# Altium schematic sheet J-Link On Board with RA4M2.SchDoc
size A3; Company Name: Renesas Electronics America; CompanyURL: www.renesas.com; PageSetup: Record=PageOptions|CenterHorizontal=True|CenterVertical=True|PrintScale=1.00|XCorrection=1.00|YCorrection=1.00|PrintKind=1|BorderSize=5000000|LeftOffset=0|BottomOffset=0|Orientation=2|PaperLength=1000|PaperWidth=1000|Scale=100|PaperSource=7|PrintQuality=-4|MediaType=1|DitherType=10|PaperKind=A5 148x210mm|PrintScaleMode=1; ReleaseDate: 16.09.2025; Version: MP; SheetNumber: 8; SheetTotal: 18; VariantNumber: 0; DSheetNumber: 1
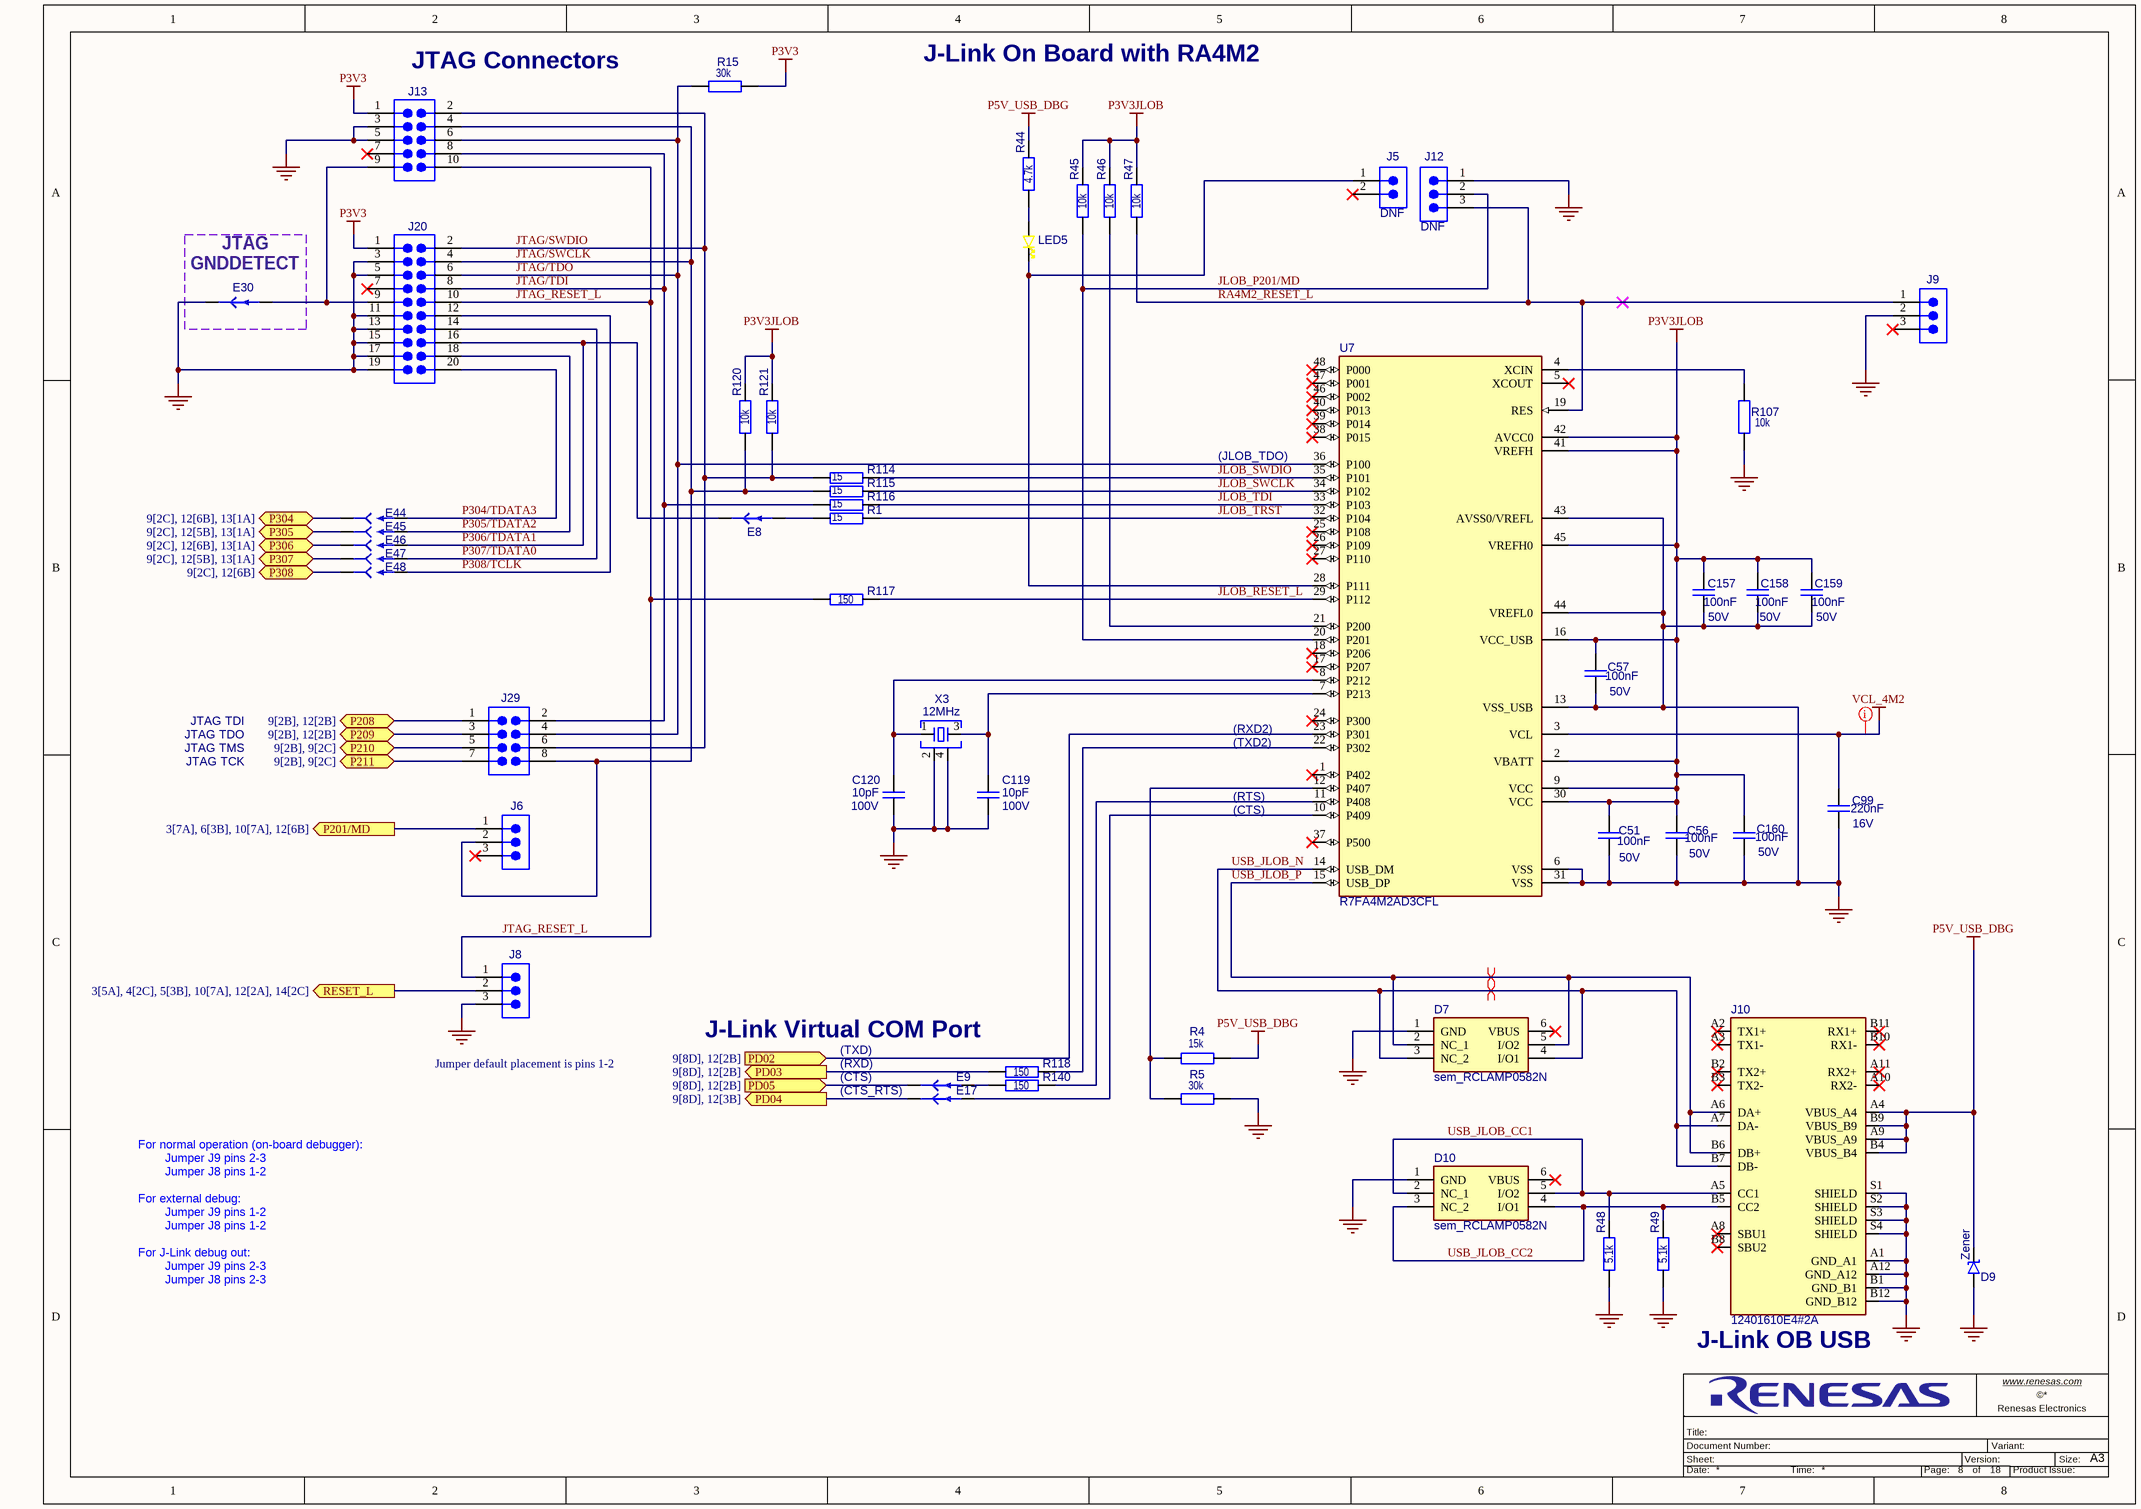
[diagram p0: J-Link On Board with RA4M2.SchDoc]

## Parts
C51  value 100nF  Operating Voltage Max: 50V  [C_EIA0402_0p55]  (hidden comment: Capacitor)
C56  value 100nF  Operating Voltage Max: 50V  [C_EIA0402_0p55]  (hidden comment: Capacitor)
C57  value 100nF  Operating Voltage Max: 50V  [C_EIA0402_0p55]  (hidden comment: Capacitor)
C99  value 220nF  Operating Voltage Max: 16V  [C_EIA0402_0p55]  (hidden comment: Capacitor)
C119  value 10pF  Operating Voltage Max: 100V  [C_EIA0402_0p55]  (hidden comment: Capacitor)
C120  value 10pF  Operating Voltage Max: 100V  [C_EIA0402_0p55]  (hidden comment: Capacitor)
C157  value 100nF  Operating Voltage Max: 50V  [C_EIA0402_0p55]  (hidden comment: Capacitor)
C158  value 100nF  Operating Voltage Max: 50V  [C_EIA0402_0p55]  (hidden comment: Capacitor)
C159  value 100nF  Operating Voltage Max: 50V  [C_EIA0402_0p55]  (hidden comment: Capacitor)
C160  value 100nF  Operating Voltage Max: 50V  [C_EIA0402_0p55]  (hidden comment: Capacitor)
D7  sem_RCLAMP0582N  [sem_SLP-6_SLP1210N6]
D9  Zener  [sem_SGP-2_SGP1610N2]
D10  sem_RCLAMP0582N  [sem_SLP-6_SLP1210N6]
E8  TRACE_CUT_0805  [trace_cut_0805]  (value not drawn)  (net tie, no BOM)
E9  TRACE_CUT_0805  [trace_cut_0805]  (value not drawn)  (net tie, no BOM)
E17  TRACE_CUT_0805  [trace_cut_0805]  (value not drawn)  (net tie, no BOM)
E30  TRACE_CUT_0805  [trace_cut_0805]  (value not drawn)  (net tie, no BOM)
E44  SOLDER_BRIDGE_0805  [solder_bridge_0805]  (value not drawn)  (no BOM)
E45  SOLDER_BRIDGE_0805  [solder_bridge_0805]  (value not drawn)  (no BOM)
E46  SOLDER_BRIDGE_0805  [solder_bridge_0805]  (value not drawn)  (no BOM)
E47  SOLDER_BRIDGE_0805  [solder_bridge_0805]  (value not drawn)  (no BOM)
E48  SOLDER_BRIDGE_0805  [solder_bridge_0805]  (value not drawn)  (no BOM)
J5  NRPN021PAEN-RC  [sul_NRPN021PAEN-RC]  (value not drawn)
J6  2842102-3  [tec_2842102-3]  (value not drawn)
J8  2842102-3  [tec_2842102-3]  (value not drawn)
J9  2842102-3  [tec_2842102-3]  (value not drawn)
J10  12401610E4#2A  [amp_12401610E42A]
J12  NRPN031PAEN-RC  [sul_NRPN031PAEN-RC]  (value not drawn)
J13  FTSH-105-01-F-DV-K-TR  [sam_FTSH-105-01-F-DV-K-TR]  (value not drawn)
J20  FTSH-110-01-F-DV-K-TR  [sam_FTSH-110-01-L-DV-K-TR]  (value not drawn)
J29  NRPN042MAMS-RC  [sul_NRPN042MAMS-RC]  (value not drawn)
LED5  150060YS75000  [led_0603_y]  (value not drawn)
R1  value 15  [R_EIA0402]  (hidden comment: RC0402FR-0715RL)
R4  value 15k  [R_EIA0402]  (hidden comment: RC0402FR-0715KL)
R5  value 30k  [R_EIA0402]  (hidden comment: RC0402FR-0730KL)
R15  value 30k  [R_EIA0402]  (hidden comment: RC0402FR-0730KL)
R44  value 4.7k  [R_EIA0402]  (hidden comment: Resistor)
R45  value 10k  [R_EIA0402]  (hidden comment: Resistor)
R46  value 10k  [R_EIA0402]  (hidden comment: Resistor)
R47  value 10k  [R_EIA0402]  (hidden comment: Resistor)
R48  value 5.1k  [R_EIA0402]  (hidden comment: Resistor)
R49  value 5.1k  [R_EIA0402]  (hidden comment: Resistor)
R107  value 10k  [R_EIA0402]  (hidden comment: Resistor)
R114  value 15  [R_EIA0402]  (hidden comment: RC0402FR-0715RL)
R115  value 15  [R_EIA0402]  (hidden comment: RC0402FR-0715RL)
R116  value 15  [R_EIA0402]  (hidden comment: RC0402FR-0715RL)
R117  value 150  [R_EIA0402]  (hidden comment: Resistor)
R118  value 150  [R_EIA0402]  (hidden comment: Resistor)
R120  value 10k  [R_EIA0402]  (hidden comment: Resistor)
R121  value 10k  [R_EIA0402]  (hidden comment: Resistor)
R140  value 150  [R_EIA0402]  (hidden comment: Resistor)
U7  R7FA4M2AD3CFL  [ren_LQFP-48_PLQP0048KB-B]
X3  value 12MHz  [ecs_ECX-2236B]  (hidden comment: ECS-120-10-36B-CWY-TR)

## Ports
P201/MD (out, see 3[7A], 6[3B], 10[7A], 12[6B]), P208 (bidir, see 9[2B], 12[2B]), P209 (bidir, see 9[2B], 12[2B]), P210 (bidir, see 9[2B], 9[2C]), P211 (bidir, see 9[2B], 9[2C]), P304 (bidir, see 9[2C], 12[6B], 13[1A]), P305 (bidir, see 9[2C], 12[5B], 13[1A]), P306 (bidir, see 9[2C], 12[6B], 13[1A]), P307 (bidir, see 9[2C], 12[5B], 13[1A]), P308 (bidir, see 9[2C], 12[6B]), PD02 (in, see 9[8D], 12[2B]), PD03 (out, see 9[8D], 12[2B]), PD04 (out, see 9[8D], 12[3B]), PD05 (in, see 9[8D], 12[2B]), RESET_L (out, see 3[5A], 4[2C], 5[3B], 10[7A], 12[2A], 14[2C])

## Nets
GND: C51.1 C56.1 C57.1 C99.1 C119.2 C120.2 C157.1 C158.1 C159.1 C160.1 D7.1(GND) D9.2(A) D10.1(GND) E30.1 J8.3 J9.2 J10.A1(GND_A1) J10.A12(GND_A12) J10.B1(GND_B1) J10.B12(GND_B12) J10.S1(SHIELD) J10.S2(SHIELD) J10.S3(SHIELD) J10.S4(SHIELD) J12.1 J13.3 J13.5 J20.3 J20.5 J20.11 J20.13 J20.15 J20.17 J20.19 R5.2 R48.1 R49.1 R107.1 U7.6(VSS) U7.13(VSS_USB) U7.31(VSS) U7.43(AVSS0/VREFL) U7.44(VREFL0) X3.2 X3.4
P3V3: J13.1 J20.1 R15.2
P3V3JLOB: C51.2 C56.2 C57.2 C157.2 C158.2 C159.2 C160.2 R45.2 R46.2 R47.2 R120.2 R121.2 U7.2(VBATT) U7.9(VCC) U7.16(VCC_USB) U7.30(VCC) U7.41(VREFH) U7.42(AVCC0) U7.45(VREFH0)
P5V_USB_DBG: D9.1(K) J10.A4(VBUS_A4) J10.A9(VBUS_A9) J10.B4(VBUS_B4) J10.B9(VBUS_B9) R4.1 R44.2
VCL_4M2: C99.2 U7.3(VCL)
JLOB_P201/MD: J12.2 R45.1 U7.20(P201)
JLOB_RESET_L: R117.2 U7.29(P112)
JLOB_SWCLK: R115.2 U7.34(P102)
JLOB_SWDIO: R114.2 U7.35(P101)
JLOB_TDI: R116.2 U7.33(P103)
JLOB_TRST: R1.2 U7.32(P104)
JTAG/SWCLK: J6.2 J13.4 J20.4 J29.8 R115.1 R120.1
JTAG/SWDIO: J13.2 J20.2 J29.6 R114.1 R121.1
JTAG/TDI: J13.8 J20.8 J29.2 R116.1
JTAG/TDO: J13.6 J20.6 J29.4 R15.1 U7.36(P100)
JTAG_RESET_L: J8.1 J13.10 J20.10 R117.1
P201/MD: J6.1 ; port P201/MD
P208: J29.1 ; port P208
P209: J29.3 ; port P209
P210: J29.5 ; port P210
P211: J29.7 ; port P211
P304: E44.1 ; port P304
P304/TDATA3: E44.2 J20.20
P305: E45.1 ; port P305
P305/TDATA2: E45.2 J20.18
P306: E46.1 ; port P306
P306/TDATA1: E8.1 E46.2 J20.16
P307: E47.1 ; port P307
P307/TDATA0: E47.2 J20.14
P308: E48.1 ; port P308
P308/TCLK: E48.2 J20.12
PD02: U7.23(P301) ; port PD02
PD03: R118.1 ; port PD03
PD04: E17.1 ; port PD04
PD05: E9.1 ; port PD05
RA4M2_RESET_L: J9.1 J12.3 R47.1 U7.19(RES)
RESET_L: J8.2 ; port RESET_L
USB_JLOB_CC1: D10.2(NC_1) D10.5(I/O2) J10.A5(CC1) R48.2
USB_JLOB_CC2: D10.3(NC_2) D10.4(I/O1) J10.B5(CC2) R49.2
USB_JLOB_N: D7.3(NC_2) D7.4(I/O1) J10.A7(DA-) J10.B7(DB-) U7.14(USB_DM)
USB_JLOB_P: D7.2(NC_1) D7.5(I/O2) J10.A6(DA+) J10.B6(DB+) U7.15(USB_DP)
NetC119_1: C119.1 U7.7(P213) X3.3
NetC120_1: C120.1 U7.8(P212) X3.1
NetE8_2: E8.2 R1.1
NetE9_2: E9.2 R140.1
NetE17_2: E17.2 U7.10(P409)
NetE30_2: E30.2 J13.9 J20.9
NetJ5_1: J5.1 LED5.1(K) U7.28(P111)
NetLED5_2: LED5.2(A) R44.1
NetR4_2: R4.2 R5.1 U7.12(P407)
NetR46_1: R46.1 U7.21(P200)
NetR107_2: R107.2 U7.4(XCIN)
NetR118_2: R118.2 U7.22(P302)
NetR140_2: R140.2 U7.11(P408)

Not connected (* = marked no-connect by the designer): D7 6(VBUS)*; D10 6(VBUS)*; J5 2*; J6 3*; J9 3*; J10 A2(TX1+)* A3(TX1-)* A8(SBU1)* A10(RX2-)* A11(RX2+)* B2(TX2+)* B3(TX2-)* B8(SBU2)* B10(RX1-)* B11(RX1+)*; J13 7*; J20 7*; U7 1(P402)* 5(XCOUT)* 17(P207)* 18(P206)* 24(P300)* 25(P108)* 26(P109)* 27(P110)* 37(P500)* 38(P015)* 39(P014)* 40(P013)* 46(P002)* 47(P001)* 48(P000)*

## Layout directives
differential pair; differential pair class USBJLOB: USB_JLOB_N, USB_JLOB_P
net class Power; rule Supply Nets [Voltage = 1.200]: VCL_4M2

## Notes on the sheet
- (near J13) JTAG Connectors
- J-Link On Board with RA4M2
- (near E30) JTAG
- (near E30) GNDDETECT
- (JLOB_TDO)
- JTAG TDI
- JTAG TDO
- JTAG TMS
- JTAG TCK
- (RXD2)
- (TXD2)
- (RTS)
- (CTS)
- J-Link Virtual COM Port
- (TXD)
- Jumper default placement is pins 1-2
- (RXD)
- (CTS_RTS)
- For normal operation (on-board debugger):
- Jumper J9 pins 2-3
- Jumper J8 pins 1-2
- For external debug:
- For J-Link debug out:
- Jumper J9 pins 1-2
- Jumper J8 pins 2-3
- (near J10) J-Link OB USB
- www.renesas.com <http://www.renesas.com>
- Sheet:
- Title:
- Document Number:
- Version:
- Variant:
- Renesas Electronics
- Size:
- A3
- Date:
- Time:
- Page:
- of
- Product Issue:

## Library data of the parts
C51 C56 C57 C157-C160 = CAP-00003203-9: Capacitor,EIA0402,100n,50V,X7R; Tolerance: 10%; Qualification: AEC-Q200; Subtype: MLCC; Dielectric: X7R; Height: 550µm; Operating Temperature Max: 125°C; Operating Temperature Min: -55°C
C99 = CAP-00003208-9: Capacitor,EIA0402,220n,16V,X7R; Tolerance: 10%; Qualification: AEC-Q200; Subtype: MLCC; Dielectric: X7R; Height: 550µm; Operating Temperature Max: 125°C; Operating Temperature Min: -55°C
C119 C120 = CAP-00003215-9: Capacitor,EIA0402,10p,100V,C0G; Tolerance: 5%; Qualification: AEC-Q200; Subtype: MLCC; Dielectric: C0G; Height: 550µm; Operating Temperature Max: 125°C; Operating Temperature Min: -55°C
D7 D10 = DIO-00003463-14: Low Capacitance TVS Diode Array; Qualification: AEC-Q100; Reverse Voltage: 6.5V; Subtype: ESD; Height: 580µm; Operating Temperature Max: 125°C; Operating Temperature Min: -40°C
D9 = DIO-00000001-5: ESD Suppressor Diode TVS Uni-Dir 22V 55Vc Automotive 2-Pin SGP T/R; Qualification: AEC-Q100; Height: 550µm; Operating Temperature Max: 125°C; Operating Temperature Min: -40°C; Reverse Voltage: 22V; Subtype: ESD
E8 E9 E17 E30 = MIS-00000000-11: Trace Cut, SMD, 0805 size; Value: TC; Pin Count: 2; Qualification: -; Subtype: Trace Cut
E44-E48 = MIS-00000002-7: Solder Bridge, SMD, 0805 size; Value: SB; Subtype: Solder Bridge; Qualification: -; Pin Count: 2
J5 = CON-00000078-7: Header, 2way, 1row, vertical, 2.00mm, THT; Operating Voltage Max: 150V; Gender: male; DC Resistance: 20m; Current: 1A; Operating Temperature Max: 105°C; Height: 5.95mm; Operating Temperature Min: -40°C; Pin Count: 2; Qualification: -; DNF: DNF
J6 J8 J9 = CON-00000097-5: Header, 3way, 1row, vertical, 2.00mm, SMD; Gender: male; Current: 2A; Operating Voltage Max: 125V; Operating Temperature Max: 125°C; Pin Count: 3; Height: 6.55mm; Qualification: -; Operating Temperature Min: -40°C
J10 = CON-00000065-5: Connector USB 3.2 Gen2 Type C Horizontal SMD; Gender: female; Current: 5A; Operating Voltage Max: 20V; Pin Count: 24; Operating Temperature Max: 85°C; Qualification: -; Operating Temperature Min: -40°C; Height: 3.43mm
J12 = CON-00000079-8: Header, 3way, 1row, vertical, 2.00mm, THT; Gender: male; Operating Voltage Max: 150V; Current: 1A; DC Resistance: 20m; Operating Temperature Max: 105°C; Pin Count: 3; Operating Temperature Min: -40°C; Qualification: -; Height: 5.95mm; DNF: DNF
J13 = CON-00000113-3: Header,10way,2row,vertical,1.27mm,SMD; Gender: male; Current: 3.4A; Operating Temperature Max: 125°C; Height: 6.12mm; Pin Count: 10; Operating Temperature Min: -55°C; Qualification: -
J20 = CON-00000114-3: Header,20way,2row,vertical,1.27mm,SMD,gold flash on post; Gender: male; Current: 3.4A; Operating Temperature Max: 125°C; Qualification: -; Height: 6.12mm; Operating Temperature Min: -55°C; Pin Count: 20
J29 = CON-00000105-7: Header, 8way, 2row, vertical, 2.0mm, SMD; DC Resistance: 20m; Operating Voltage Max: 150V; Current: 2A; Gender: male; Pin Count: 8; Operating Temperature Min: -40°C; Height: 6.2mm; Qualification: -; Operating Temperature Max: 105°C
LED5 = DIO-00000015-5: Standard LEDs - SMD Yellow, 590nm 90 to 120 mcd; Subtype: LED; Reverse Voltage: 5V; Current: 30mA; Forward Voltage: 2V; Operating Temperature Min: -40°C; Height: 800µm; Qualification: -; Operating Temperature Max: 85°C
R1 R114-R116 = RES-00000834-9: Resistor,EIA0402,15,0.0625W; Tolerance: 1%; Power: 62.5mW; Subtype: Chip Resistor; Operating Temperature Min: -55°C; Qualification: -; Operating Temperature Max: 155°C
R4 = RES-00000906-9: Resistor,EIA0402,15k,0.0625W; Tolerance: 1%; Power: 62.5mW; Subtype: Chip Resistor; Operating Temperature Min: -55°C; Qualification: -; Operating Temperature Max: 155°C
R5 R15 = RES-00000913-9: Resistor,EIA0402,30k,0.0625W; Subtype: Chip Resistor; Tolerance: 1%; Power: 62.5mW; Qualification: -; Operating Temperature Min: -55°C; Operating Temperature Max: 155°C
R44 = RES-00000894-9: Resistor,EIA0402,4.7k,0.0625W; Power: 62.5mW; Tolerance: 1%; Subtype: Chip Resistor; Operating Temperature Max: 155°C; Operating Temperature Min: -55°C; Qualification: -
R45-R47 R107 R120 R121 = RES-00000902-9: Resistor,EIA0402,10k,0.0625W; Power: 62.5mW; Tolerance: 1%; Subtype: Chip Resistor; Operating Temperature Max: 155°C; Operating Temperature Min: -55°C; Qualification: -
R48 R49 = RES-00000895-9: Resistor,EIA0402,5.1k,0.0625W; Power: 62.5mW; Tolerance: 1%; Subtype: Chip Resistor; Operating Temperature Max: 155°C; Operating Temperature Min: -55°C; Qualification: -
R117 R118 R140 = RES-00000858-9: Resistor,EIA0402,150,0.0625W; Power: 62.5mW; Tolerance: 1%; Subtype: Chip Resistor; Operating Temperature Max: 155°C; Operating Temperature Min: -55°C; Qualification: -
U7 = ICS-00000006-18: Renesas RA4M2 32-bit MCU, ARM Cortex-M33, 100MHz, 512kB Flash, 128 kB RAM, 48-pin LQFP package (used for J-Link onboard debug i/f); Operating Voltage Min: 2.7V; Subtype: MCU/MPU; Current: 65mA; Operating Voltage Max: 3.6V; Qualification: -; Operating Temperature Max: 105°C; Frequency: 100MHz; Operating Temperature Min: -40°C; Pin Count: 48
X3 = CRY-00000002-11: Crystal, 12.000MHz, 10 pF, 2.5x2; Load Capacitance: 10pF; Temperature Coefficient: 15ppm; Tolerance: 10ppm; Height: 600µm; Operating Temperature Max: 85°C; Operating Temperature Min: -30°C; Qualification: -; Subtype: Crystal